# Altium schematic sheet IMD_Filtering.SchDoc: QUTMS Shutdown V2 - IMD_Filtering
size A4; Author: Jonn Dillon; Organization: QUT Motorsport; Address1: O-120; Address2: O Block; Address3: QUT Gardens Point; Address4: Brisbane, 4000; DocumentNumber: 6; SheetNumber: 6; SheetTotal: 13
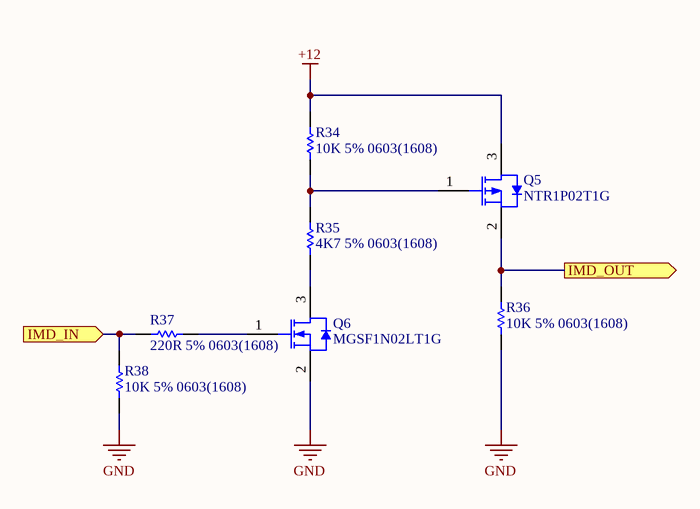
[diagram p0: IMD_Filtering.SchDoc]

## Parts
Q5  NTR1P02T1G  [ONSC-SOT-23-3-318-08_V]
Q6  MGSF1N02LT1G  [ONSC-SOT-23-3-318-08_V]
R34  10K 5% 0603(1608)  [RESC0603(1608)_N]
R35  4K7 5% 0603(1608)  [RESC0603(1608)_N]
R36  10K 5% 0603(1608)  [RESC0603(1608)_N]
R37  220R 5% 0603(1608)  [RESC0603(1608)_M]
R38  10K 5% 0603(1608)  [RESC0603(1608)_N]

## Ports
IMD_IN (in), IMD_OUT (out)

## Nets
+12: Q5.3(D) R34.2
GND: Q6.2(S) R36.1 R38.1
IMD_IN: R37.1 R38.2 ; port IMD_IN
IMD_OUT: Q5.2(S) R36.2 ; port IMD_OUT
NetQ5_1: Q5.1(G) R34.1 R35.2
NetQ6_1: Q6.1(G) R37.2
NetQ6_3: Q6.3(D) R35.1

## Notes on the sheet
- Title
- Size:
- Date:
- A4
- Number:
- Time:
- Revision:
- Sheet
- of
- File:

## Library data of the parts
Q5 = CMP-1058-00751-1: Power MOSFET, -20 V, -1 A, P-Channel, 3-Pin SOT-23, Pb-Free, Tape and Reel; Manufacturer: On Semiconductor; Ciss Typ (pF): 165; Coss Typ (pF): 110; Qrr Typ (nC): 8; Crss Typ (pF): 35; V(BR)DSS Min (V): 20; VGS(th) Max (V): 2.3; Configuration: Single; ID Max (A): 1; Channel Polarity: P Channel; PD Max (W): 0.4; ComponentLink2Description: Datasheet; ComponentLink3URL: http://www.onsemi.cn/pub_link/Collateral/318-08.PDF; PackageReference: SOT-23-3-318-08; ComponentLink1Description: Manufacturer URL; Mounting Technology: Surface Mount; RoHS: Pb-Free; Package Type: SOT-23-3; DatasheetVersion: Rev. 7; PackageVersion: Rev. AP, 11/2009; Packing: Tape and Reel; PackageDescription: 3-Pin Small Outline Transistor, Body 2.92 x 1.3 mm, Pitch 0.95 mm; VGS Max (V): 20; ComponentLink3Description: Package Specification; ComponentLink1URL: http://www.onsemi.com/; PartNumber: NTR1P02T1G; ComponentLink2URL: http://www.onsemi.cn/pub_link/Collateral/NTR1P02T1-D.PDF
Q6 = CMP-1058-00777-1: Power MOSFET, 750 mA, 20 V, N-Channel, 3-Pin SOT-23, Pb-Free, Tape and Reel; Manufacturer: On Semiconductor; Crss Typ (pF): 45; Ciss Typ (pF): 125; VGS(th) Max (V): 2.4; Coss Typ (pF): 120; PD Max (W): 0.4; VGS Max (V): 20; Configuration: Single; Channel Polarity: N Channel; ID Max (A): 0.75; PackageReference: SOT-23-3-318-08; ComponentLink2Description: Datasheet; PackageVersion: Rev. AP, 11/2009; ComponentLink1URL: http://www.onsemi.com/; RoHS: Pb-Free; Mounting Technology: Surface Mount; Package Type: SOT-23-3; ComponentLink1Description: Manufacturer URL; V(BR)DSS Min (V): 20; PackageDescription: 3-Pin Small Outline Transistor, Body 2.92 x 1.3 mm, Pitch 0.95 mm; Packing: Tape and Reel; PartNumber: MGSF1N02LT1G; DatasheetVersion: Rev. 6; ComponentLink2URL: http://www.onsemi.cn/pub_link/Collateral/MGSF1N02LT1-D.PDF; ComponentLink3URL: http://www.onsemi.cn/pub_link/Collateral/318-08.PDF; ComponentLink3Description: Package Specification
R34 R36 R38 = CMP-1012-00098-1: 10K 0.1W 5% 0603 (1608 Metric)  SMD; Case-EIA: 0603; Value: 10000.00 Ohm; Case-Metric: 1608; Technology: SMT; Tolerance: 5 %; Power: 0.1 W
R35 = CMP-1012-00090-1: 4K7 0.1W 5% 0603 (1608 Metric)  SMD; Case-Metric: 1608; Value: 4700.00 Ohm; Case-EIA: 0603; Tolerance: 5 %; Technology: SMT; Power: 0.1 W
R37 = CMP-1012-00058-1: 220R 0.1W 5% 0603 (1608 Metric)  SMD; Case-EIA: 0603; Case-Metric: 1608; Value: 220.00 Ohm; Technology: SMT; Power: 0.1 W; Tolerance: 5 %